# Altium project PCB_Project.PrjPcb
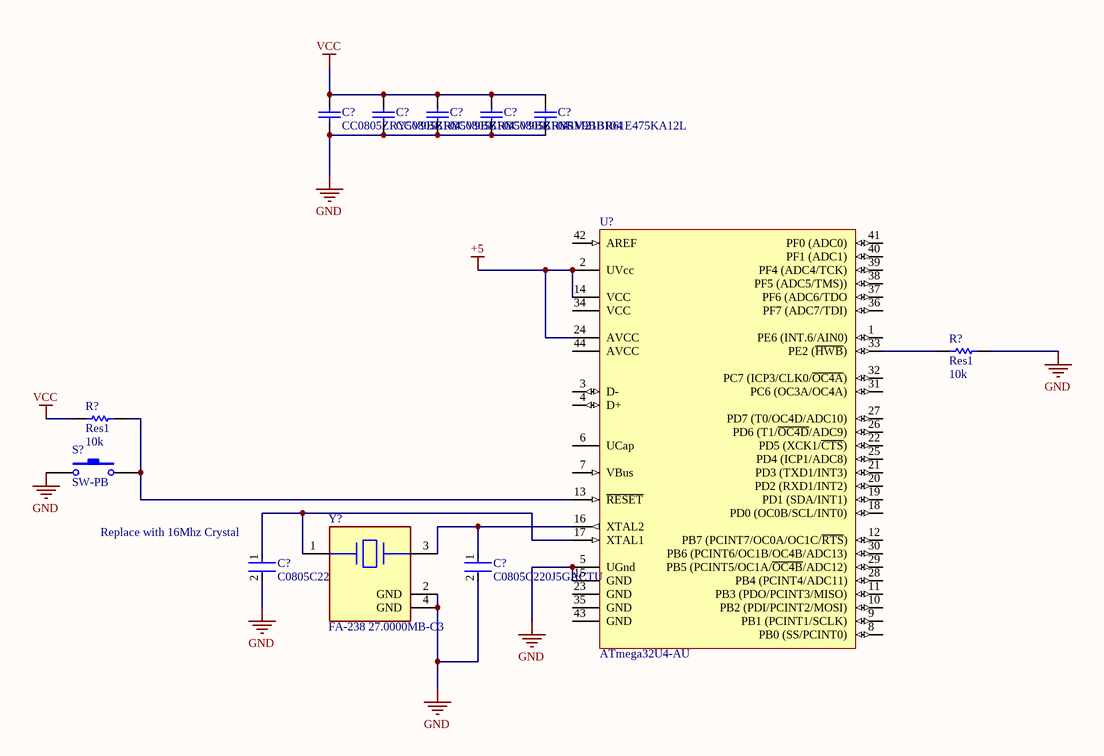
[diagram p0: keyboard-schem.SchDoc]
1 sheet, 12 parts. Net scope: global (net labels, ports and power ports of the same name join across sheets).

## Sheet keyboard-schem.SchDoc
size A4; SheetNumber: 1; SheetTotal: 1

### Parts
(Parts that share a designator on the sheet are numbered #1, #2 ... from top to bottom, then left to right.)
C?#1  GRM21BR61E475KA12L  [CAPC2013X135X45NL10T25]
C?#2  CC0805ZRY5V9BB104  [CAPC2013X70X50ML10T25]
C?#3  CC0805ZRY5V9BB104  [CAPC2013X70X50ML10T25]
C?#4  CC0805ZRY5V9BB104  [CAPC2013X70X50ML10T25]
C?#5  CC0805ZRY5V9BB104  [CAPC2013X70X50ML10T25]
C?#6  C0805C220J5GACTU  [FP-C0805C-DN-MFG]
C?#7  C0805C220J5GACTU  [FP-C0805C-DN-MFG]
R?#1  Res1  value 10k  [AXIAL-0.3]
R?#2  Res1  value 10k  [AXIAL-0.3]
S?  SW-PB  [SPST-2]
U?  ATmega32U4-AU  [44ML_M]
Y?  FA-238 27.0000MB-C3  [FP-FA-238_27_0000MB-C3-MFG]

### Nets
+5: U?.2(UVcc) U?.14(VCC) U?.24(AVCC)
GND: C?#1.1 C?#2.1 C?#3.1 C?#4.1 C?#5.1 C?#6.2 C?#7.2 R?#1.2 S?.1 U?.5(UGnd) U?.15(GND) Y?.2(GND) Y?.4(GND)
VCC: C?#1.2 C?#2.2 C?#3.2 C?#4.2 C?#5.2 R?#2.1
NetC?#6_1: C?#6.1 U?.17(XTAL1) Y?.1
NetC?#7_1: C?#7.1 U?.16(XTAL2) Y?.3
NetR?#1_1: R?#1.1 U?.33(PE2_(~{HWB}))
NetR?#2_2: R?#2.2 S?.2 U?.13(~{RESET})

Not connected (* = marked no-connect by the designer): U? 1(PE6_(INT.6/AIN0)) 3(D-) 4(D+) 6(UCap) 7(VBus) 8(PB0_(SS/PCINT0)) 9(PB1_(PCINT1/SCLK)) 10(PB2_(PDI/PCINT2/MOSI)) 11(PB3_(PDO/PCINT3/MISO)) 12(PB7_(PCINT7/OC0A/OC1C/~{RTS})) 18(PD0_(OC0B/SCL/INT0)) 19(PD1_(SDA/INT1)) 20(PD2_(RXD1/INT2)) 21(PD3_(TXD1/INT3)) 22(PD5_(XCK1/~{CTS})) 23(GND) 25(PD4_(ICP1/ADC8)) 26(PD6_(T1/~{OC4D}/ADC9)) 27(PD7_(T0/OC4D/ADC10)) 28(PB4_(PCINT4/ADC11)) 29(PB5_(PCINT5/OC1A/~{OC4B}/ADC12)) 30(PB6_(PCINT6/OC1B/OC4B/ADC13)) 31(PC6_(OC3A/OC4A)) 32(PC7_(ICP3/CLK0/~{OC4A})) 34(VCC) 35(GND) 36(PF7_(ADC7/TDI)) 37(PF6_(ADC6/TDO) 38(PF5_(ADC5/TMS))) 39(PF4_(ADC4/TCK)) 40(PF1_(ADC1)) 41(PF0_(ADC0)) 42(AREF) 43(GND) 44(AVCC)

### Notes on the sheet
- (near C?#6) Replace with 16Mhz Crystal

### Library data of the parts
C?#1 = CMP-2007-03545-1: Manufacturer: Murata; Part Number: GRM21BR61E475KA12L
C?#2-C?#5 = CMP-1036-04425-2: Chip Capacitor, 0.1 uF, -20% to 80%, 50 V, -30 to 85 degC, 0805 (2012 Metric), RoHS, Tape and Reel; Manufacturer: Yageo; Capacitance: 0.1µF; Catalog Drawings: CC_0805_0.6; Featured Product: CommodityMultilayerCeramicCapacitors–CCSeries; Other Names: 311-1361-6; Tolerance: -20%,+80%; Voltage - Rated: 50V; Temperature Coefficient: Y5V(F); Online Catalog: CCSeries; Features: -; Operating Temperature: -30degC~85degC; Packaging: Digi-Reel; Height - Seated (Max): -; Category: Capacitors; Lead Spacing: -; Mounting Type: SurfaceMount,MLCC; Lead Style: -; Datasheet Version: Rev. 5, 07/2010; Series: CC; Manufacturer URL: http://www.yageo.com/; Package Reference: 0805 (2012 Metric); Package Description: 2-Pin Surface Mount Device, Body 2 x 1.25 mm; Ratings: -; Size / Dimension: 0.079"Lx0.049"W(2.00mmx1.25mm); Applications: GeneralPurpose; Family: CeramicCapacitors; Package / Case: 0805(2012Metric); Thickness (Max): 0.024"(0.60mm); Datasheet URL: http://download.siliconexpert.com/pdfs/2012/8/14/1/40/50/201/yageo_/manual/upy-gphc_y5v_6.3v-to-50v_5_revised.pdf; Standard Package: 1
C?#6 C?#7 = CMP-2007-00048-2: Capacitor; Ceramic; Cap; 22.0pF; Tol 5%; SMT; Vol-Rtg 50V; C0G; Tape and Reel; Manufacturer: KEMET; Temperature Coefficient: 30ppm/°C; Capacitance: 22 pF; Value: 22 pF; Tolerance: 0.05; Device Class L1: Passive Components; Mouser Description: Multilayer Ceramic Capacitors MLCC - SMD/SMT 50volts 22pF C0G 5%; Temperature Range Low: -55°C; Automotive: No; Voltage Rating: 50 V; Material: Ceramic; Category: Cap; Height: 0.88mm; Temperature Range High: +125°C; Digikey Description: Capacitor; Ceramic; Cap; 22.0pF; Tol 5%; SMT; Vol-Rtg 50V; C0G; Tape and Reel; Octopart: https://octopart.com/c0805c220j5gactu-kemet-145470; ComponentLink2Description: Datasheet; Device Class L2: Capacitors; Ipc Land Pattern Name: CAPC200125X78; RoHS: TRUE; ComponentLink2URL: https://content.kemet.com/datasheets/KEM_C1003_C0G_SMD.pdf; Temperature: -55°C to +125°C; Device Class L3: Ceramic Capacitors; Lead Free: Yes; Manufacturer Part Number: C0805C220J5GACTU; Temperature Characteristic: C0G; Package: C0805C-DN
R?#1 R?#2 = Res1: Resistor; Published: 8-Jun-2000; LatestRevisionDate: 17-Jul-2002; LatestRevisionNote: Re-released for DXP Platform.; PackageReference: AXIAL-0.3; Publisher: Altium Limited; PackageDescription: Axial Device, Thru-Hole; 2 Leads; 0.3 in Pin Spacing
S? = SW-PB: Switch; Published: 24-Mar-1999; LatestRevisionDate: 17-Jul-2002; LatestRevisionNote: Re-released for DXP Platform.; PackageReference: SPST-2; Publisher: Altium Limited; PackageDescription: Switch; 2 Leads
U? = CMP-0095-00285-2: 8-bit AVR Microcontroller, 2.7-5.5V, 16MHz, 32KB Flash, 1KB EEPROM, 2.5KB SRAM, USB Controller, 44-pin TQFP, Industrial Grade (-40°C to 85°C), Ext Osc; RevisionNote: DatasheetVersion updated. URLs added.; ComponentLink1Description: Manufacturer URL; PackageDescription: 44-Pin Plastic Thin Quad Flat Pack, 10 x 10 x 1.0 mm Body, 0.8 mm Pitch (TQFP); DatasheetVersion: revF, Nov-2010; ComponentLink2URL: http://www.atmel.com/dyn/resources/prod_documents/doc7766.pdf; ComponentLink1URL: http://www.atmel.com/; PackageReference: 44ML; ComponentLink2Description: ATmega16U4/32U4 Datasheet; PackageVersion: rev.G, Jul-2007; ComponentLink3URL: http://www.atmel.com/dyn/resources/prod_documents/7766S.pdf; ComponentLink3Description: ATmega16U4 ATmega32U4 Summary
Y? = CMP-36405-000008-1: CRYSTAL 27.0000MHZ 18PF SMD; Manufacturer: Epson; Esr: 50Ω; Capacitance: 18.0pF; Tolerance: 50ppm; Value: 18.0pF; Frequency: 27MHz; Digikey Description: CRYSTAL 27.0000MHZ 18PF SMD; Package: 0; Height: 0.7mm; Device Class L1: Passive Components; Octopart: https://octopart.com/fa-238+27.0000mb-c3-epson-42855148; Temperature: -20°C to +70°C; Temperature Range Low: -20°C; Temperature Range High: +70°C; Device Class L3: Crystals; Lead Free: Yes; Category: Crys; Series: FA-238; Mouser Description: Crystals 27MHz 50ppm 18pF -20C +70C; Automotive: No; ComponentLink2URL: https://support.epson.biz/td/api/doc_check.php?dl=brief_fa-238v_en.pdf; Manufacturer Part Number: FA-238 27.0000MB-C3; Load Capacitance: 18pF; RoHS: TRUE; Device Class L2: Crystals / Oscillators; ComponentLink2Description: Datasheet